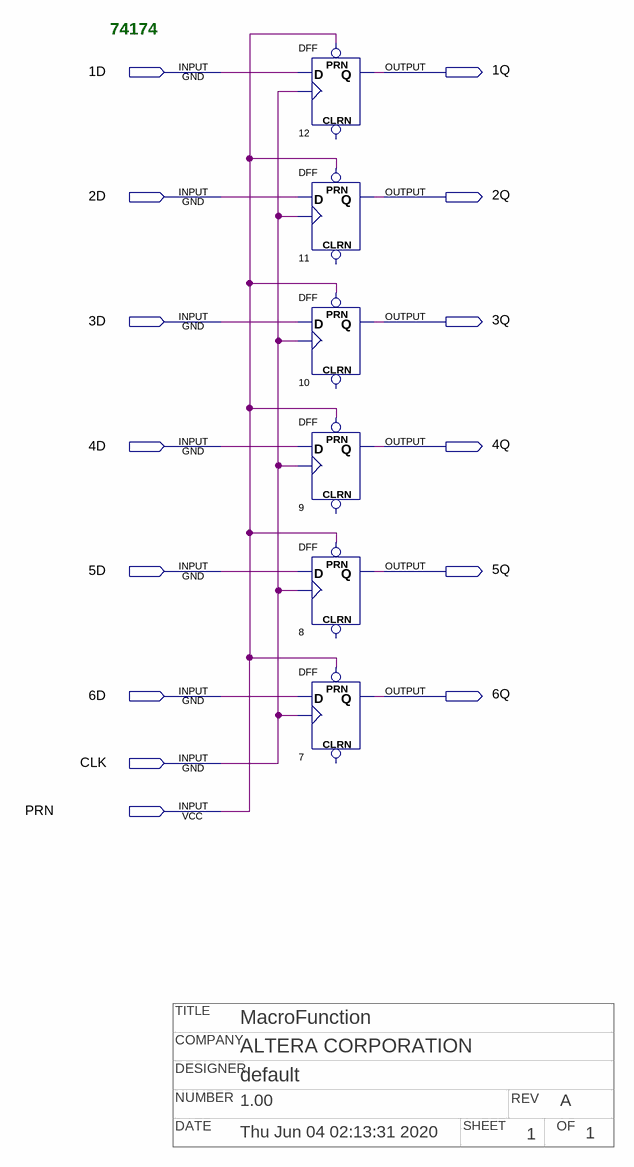
[diagram p0: schematic sheet]
// Quartus schematic 74174_PRN.bdf as structural Verilog: 6 symbols, 14 pins
// Title block: TITLE: MacroFunction; COMPANY: ALTERA CORPORATION; DESIGNER: default; NUMBER: 1.00; REV: A; DATE: Thu Jun 04 02:13:31 2020; SHEET: 1; OF: 1
module \74174_PRN  (
  input  \1D ,
  input  \2D ,
  input  \3D ,
  input  \4D ,
  input  \5D ,
  input  \6D ,
  input  CLK,
  input  PRN,
  output \1Q ,
  output \2Q ,
  output \3Q ,
  output \4Q ,
  output \5Q ,
  output \6Q 
);

  DFF u_12 (.CLK(CLK), .D(\1D ), .PRN(PRN), .Q(\1Q ));  // open: CLRN
  DFF u_11 (.CLK(CLK), .D(\2D ), .PRN(PRN), .Q(\2Q ));  // open: CLRN
  DFF u_10 (.CLK(CLK), .D(\3D ), .PRN(PRN), .Q(\3Q ));  // open: CLRN
  DFF u_9 (.CLK(CLK), .D(\4D ), .PRN(PRN), .Q(\4Q ));  // open: CLRN
  DFF u_8 (.CLK(CLK), .D(\5D ), .PRN(PRN), .Q(\5Q ));  // open: CLRN
  DFF u_7 (.CLK(CLK), .D(\6D ), .PRN(PRN), .Q(\6Q ));  // open: CLRN

  // Notes on the sheet:
  //   74174
endmodule
